# Altium schematic sheet FPGA_IO_Transceiver.SchDoc
size A4
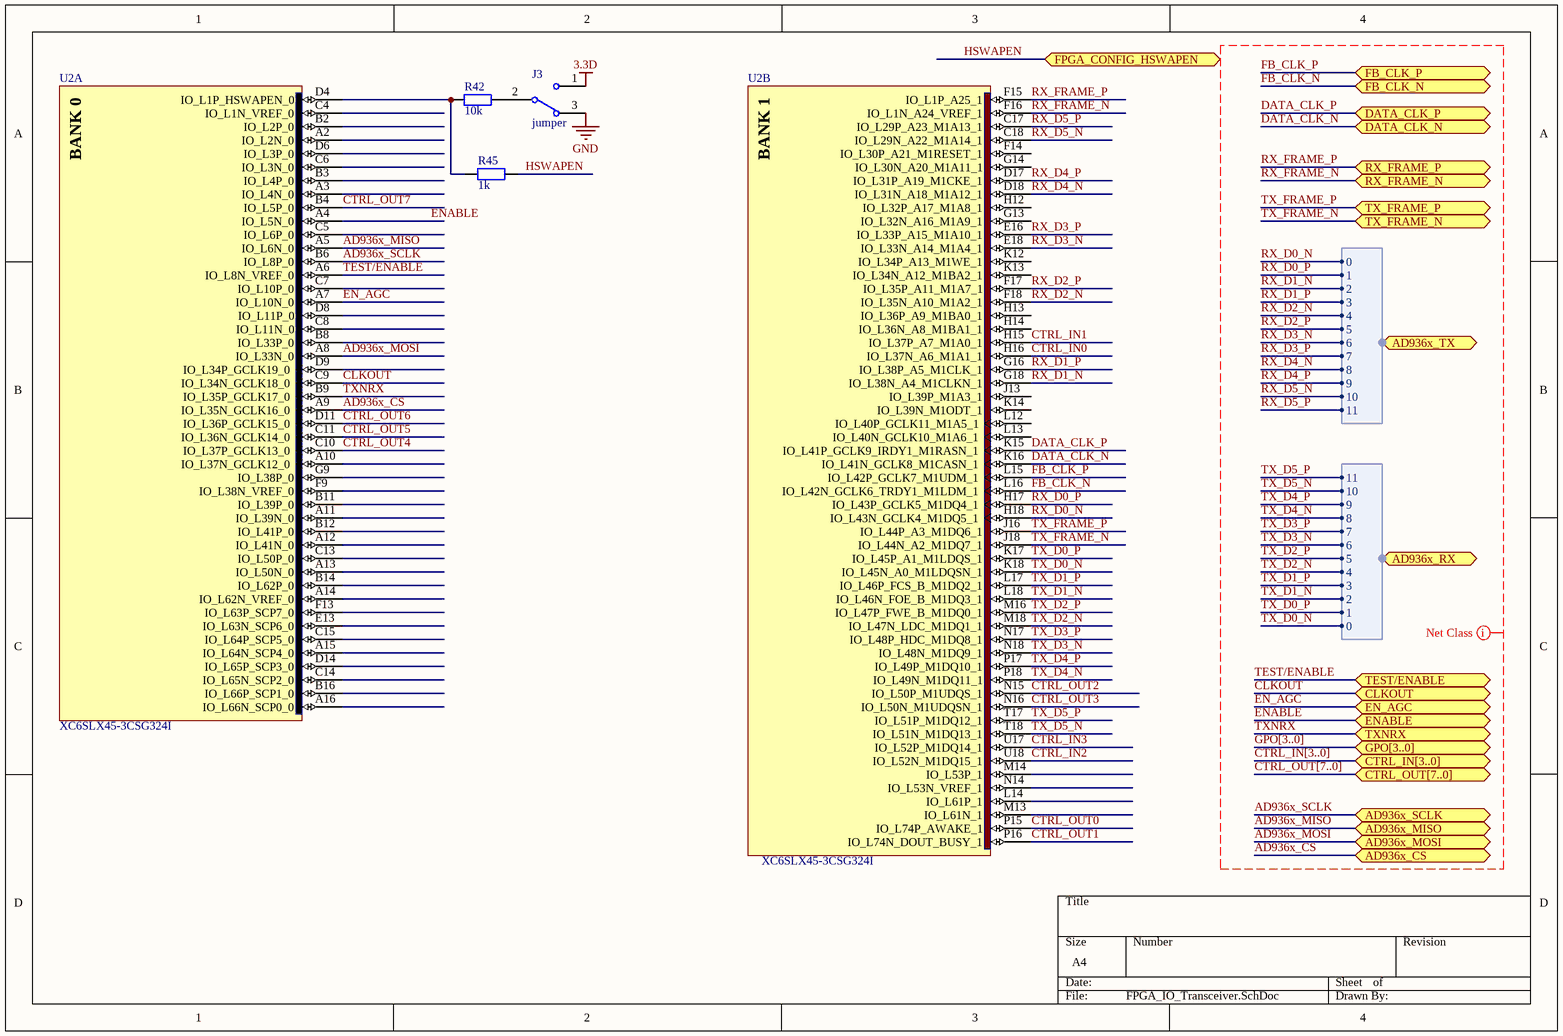
[diagram p0: FPGA_IO_Transceiver.SchDoc]

## Parts
J3  jumper  [0402J]
R42  10k  [0402]
R45  1k  [0402]
U2  XC6SLX45-3CSG324I  [CSG324]  (parts A,B of 8)

## Ports
AD936x_CS, AD936x_MISO, AD936x_MOSI, AD936x_RX (harness Harness), AD936x_SCLK, AD936x_TX (harness Harness), CLKOUT, CTRL_IN[3..0], CTRL_OUT[7..0], DATA_CLK_N, DATA_CLK_P, EN_AGC, ENABLE, FB_CLK_N, FB_CLK_P, FPGA_CONFIG_HSWAPEN, GPO[3..0], RX_FRAME_N, RX_FRAME_P, TEST/ENABLE, TX_FRAME_N, TX_FRAME_P, TXNRX

## Harnesses
Harness: 0, 1, 2, 3, 4, 5, 6, 7, 8, 9, 10, 11

## Nets
3.3D: J3.1
GND: J3.3
AD936x_CS: U2.A9(IO_L35N_GCLK16_0) ; port AD936x_CS
AD936x_MISO: U2.A5(IO_L6N_0) ; port AD936x_MISO
AD936x_MOSI: U2.A8(IO_L33N_0) ; port AD936x_MOSI
AD936x_SCLK: U2.B6(IO_L8P_0) ; port AD936x_SCLK
CLKOUT: U2.C9(IO_L34N_GCLK18_0) ; port CLKOUT
CTRL_IN0: U2.H16(IO_L37N_A6_M1A1_1)
CTRL_IN1: U2.H15(IO_L37P_A7_M1A0_1)
CTRL_IN2: U2.U18(IO_L52N_M1DQ15_1)
CTRL_IN3: U2.U17(IO_L52P_M1DQ14_1)
CTRL_OUT0: U2.P15(IO_L74P_AWAKE_1)
CTRL_OUT1: U2.P16(IO_L74N_DOUT_BUSY_1)
CTRL_OUT2: U2.N15(IO_L50P_M1UDQS_1)
CTRL_OUT3: U2.N16(IO_L50N_M1UDQSN_1)
CTRL_OUT4: U2.C10(IO_L37P_GCLK13_0)
CTRL_OUT5: U2.C11(IO_L36N_GCLK14_0)
CTRL_OUT6: U2.D11(IO_L36P_GCLK15_0)
CTRL_OUT7: U2.B4(IO_L5P_0)
DATA_CLK_N: U2.K16(IO_L41N_GCLK8_M1CASN_1) ; port DATA_CLK_N
DATA_CLK_P: U2.K15(IO_L41P_GCLK9_IRDY1_M1RASN_1) ; port DATA_CLK_P
EN_AGC: U2.A7(IO_L10N_0) ; port EN_AGC
ENABLE: U2.A4(IO_L5N_0) ; port ENABLE
FB_CLK_N: U2.L16(IO_L42N_GCLK6_TRDY1_M1LDM_1) ; port FB_CLK_N
FB_CLK_P: U2.L15(IO_L42P_GCLK7_M1UDM_1) ; port FB_CLK_P
HSWAPEN: R45.1 ; port FPGA_CONFIG_HSWAPEN
RX_D0_N: U2.H18(IO_L43N_GCLK4_M1DQ5_1) ; port AD936x_TX.0
RX_D0_P: U2.H17(IO_L43P_GCLK5_M1DQ4_1) ; port AD936x_TX.1
RX_D1_N: U2.G18(IO_L38N_A4_M1CLKN_1) ; port AD936x_TX.2
RX_D1_P: U2.G16(IO_L38P_A5_M1CLK_1) ; port AD936x_TX.3
RX_D2_N: U2.F18(IO_L35N_A10_M1A2_1) ; port AD936x_TX.4
RX_D2_P: U2.F17(IO_L35P_A11_M1A7_1) ; port AD936x_TX.5
RX_D3_N: U2.E18(IO_L33N_A14_M1A4_1) ; port AD936x_TX.6
RX_D3_P: U2.E16(IO_L33P_A15_M1A10_1) ; port AD936x_TX.7
RX_D4_N: U2.D18(IO_L31N_A18_M1A12_1) ; port AD936x_TX.8
RX_D4_P: U2.D17(IO_L31P_A19_M1CKE_1) ; port AD936x_TX.9
RX_D5_N: U2.C18(IO_L29N_A22_M1A14_1) ; port AD936x_TX.10
RX_D5_P: U2.C17(IO_L29P_A23_M1A13_1) ; port AD936x_TX.11
RX_FRAME_N: U2.F16(IO_L1N_A24_VREF_1) ; port RX_FRAME_N
RX_FRAME_P: U2.F15(IO_L1P_A25_1) ; port RX_FRAME_P
TEST/ENABLE: U2.A6(IO_L8N_VREF_0) ; port TEST/ENABLE
TX_D0_N: U2.K18(IO_L45N_A0_M1LDQSN_1) ; port AD936x_RX.0
TX_D0_P: U2.K17(IO_L45P_A1_M1LDQS_1) ; port AD936x_RX.1
TX_D1_N: U2.L18(IO_L46N_FOE_B_M1DQ3_1) ; port AD936x_RX.2
TX_D1_P: U2.L17(IO_L46P_FCS_B_M1DQ2_1) ; port AD936x_RX.3
TX_D2_N: U2.M18(IO_L47N_LDC_M1DQ1_1) ; port AD936x_RX.4
TX_D2_P: U2.M16(IO_L47P_FWE_B_M1DQ0_1) ; port AD936x_RX.5
TX_D3_N: U2.N18(IO_L48N_M1DQ9_1) ; port AD936x_RX.6
TX_D3_P: U2.N17(IO_L48P_HDC_M1DQ8_1) ; port AD936x_RX.7
TX_D4_N: U2.P18(IO_L49N_M1DQ11_1) ; port AD936x_RX.8
TX_D4_P: U2.P17(IO_L49P_M1DQ10_1) ; port AD936x_RX.9
TX_D5_N: U2.T18(IO_L51N_M1DQ13_1) ; port AD936x_RX.10
TX_D5_P: U2.T17(IO_L51P_M1DQ12_1) ; port AD936x_RX.11
TX_FRAME_N: U2.J18(IO_L44N_A2_M1DQ7_1) ; port TX_FRAME_N
TX_FRAME_P: U2.J16(IO_L44P_A3_M1DQ6_1) ; port TX_FRAME_P
TXNRX: U2.B9(IO_L35P_GCLK17_0) ; port TXNRX
NetJ3_2: J3.2 R42.1
NetR42_2: R42.2 R45.2 U2.D4(IO_L1P_HSWAPEN_0)

Not connected (* = marked no-connect by the designer): U2 A2(IO_L2N_0) A3(IO_L4N_0) A10(IO_L37N_GCLK12_0) A11(IO_L39N_0) A12(IO_L41N_0) A13(IO_L50N_0) A14(IO_L62N_VREF_0) A15(IO_L64N_SCP4_0) A16(IO_L66N_SCP0_0) B2(IO_L2P_0) B3(IO_L4P_0) B8(IO_L33P_0) B11(IO_L39P_0) B12(IO_L41P_0) B14(IO_L62P_0) B16(IO_L66P_SCP1_0) C4(IO_L1N_VREF_0) C5(IO_L6P_0) C6(IO_L3N_0) C7(IO_L10P_0) C8(IO_L11N_0) C13(IO_L50P_0) C14(IO_L65N_SCP2_0) C15(IO_L64P_SCP5_0) D6(IO_L3P_0) D8(IO_L11P_0) D9(IO_L34P_GCLK19_0) D14(IO_L65P_SCP3_0) E13(IO_L63N_SCP6_0) F9(IO_L38N_VREF_0) F13(IO_L63P_SCP7_0) F14(IO_L30P_A21_M1RESET_1) G9(IO_L38P_0) G13(IO_L32N_A16_M1A9_1) G14(IO_L30N_A20_M1A11_1) H12(IO_L32P_A17_M1A8_1) H13(IO_L36P_A9_M1BA0_1) H14(IO_L36N_A8_M1BA1_1) J13(IO_L39P_M1A3_1) K12(IO_L34P_A13_M1WE_1) K13(IO_L34N_A12_M1BA2_1) K14(IO_L39N_M1ODT_1) L12(IO_L40P_GCLK11_M1A5_1) L13(IO_L40N_GCLK10_M1A6_1) L14(IO_L61P_1) M13(IO_L61N_1) M14(IO_L53P_1) N14(IO_L53N_VREF_1)

## Buses and harness runs
bus CTRL_IN[3..0] = port CTRL_IN[3..0]
bus CTRL_OUT[7..0] = port CTRL_OUT[7..0]
bus GPO[3..0] = port GPO[3..0]

## Layout directives
net class tranciver: AD936x_CS, AD936x_MISO, AD936x_MOSI, AD936x_SCLK, CLKOUT, CTRL_IN[3..0], CTRL_OUT[7..0], DATA_CLK_N, DATA_CLK_P, EN_AGC, ENABLE, FB_CLK_N, FB_CLK_P, GPO[3..0], RX_D0_N, RX_D0_P, RX_D1_N, RX_D1_P, RX_D2_N, RX_D2_P, RX_D3_N, RX_D3_P, RX_D4_N, RX_D4_P, RX_D5_N, RX_D5_P, RX_FRAME_N, RX_FRAME_P, TEST/ENABLE, TX_D0_N, TX_D0_P, TX_D1_N, TX_D1_P, TX_D2_N, TX_D2_P, TX_D3_N, TX_D3_P, TX_D4_N, TX_D4_P, TX_D5_N, TX_D5_P, TX_FRAME_N, TX_FRAME_P, TXNRX

## Notes on the sheet
- (in symbol XC6SLX45-3CSG324I, part A) BANK 0
- (in symbol XC6SLX45-3CSG324I, part B) BANK 1

## Library data of the parts
J3 = SW-SPDT: SPDT Subminiature Toggle Switch, Right Angle Mounting, Vertical Actuation; Published: 24-Mar-1999; LatestRevisionDate: 17-Dec-2003; LatestRevisionNote: Schematic revised, PCB Footprint replaced.; DatasheetVersion: 05-Dec-2000; PackageReference: TL36WW15050; Publisher: Altium Limited; PackageDescription: Switch; 4 Leads; ComponentLink1Description: Manufacturer Link; ComponentLink1URL: http://www.apem.com
R42 R45 = Res2: Resistor; Published: 8-Jun-2000; LatestRevisionDate: 17-Jul-2002; LatestRevisionNote: Re-released for DXP Platform.; PackageReference: AXIAL-0.4; Publisher: Altium Limited; PackageDescription: Axial Device, Thru-Hole; 2 Leads; 0.4 in Pin Spacing
U2 = XC6SLX45-3CSG324I: Spartan-6 LX 1.2V FPGA, 218 User I/Os, 324-Ball Chip-Scale BGA (0.8mm Pitch), Speed Grade 3, Industrial Grade, Pb-Free; Published: 17-Nov-2009; DatasheetVersion: ver1.6, Nov-2010; PackageVersion: ver1.1, Nov-2009; PackageReference: CSG324; Publisher: Altium Limited; PackageDescription: 324-Ball Chip-Scale BGA (CSG324) Package, 0.8 mm Pitch; Supplier 1: Digi-Key; Supplier Part Number 1: XC6SLX45-3CSG324I-ND; Code_JEDEC: MO-275-KKAC-1; ComponentLink1Description: Manufacturer Link; ComponentLink1URL: http://www.xilinx.com; ComponentLink2Description: Spartan-6 Datasheet; ComponentLink2URL: http://www.xilinx.com/support/documentation/data_sheets/ds160.pdf; ComponentLink3Description: Spartan-6 Documents; ComponentLink3URL: http://www.xilinx.com/support/documentation/spartan-6.htm; ComponentLink4Description: Xilinx.com Home; ComponentLink4URL: http://www.xilinx.com